# Altium schematic sheet Fri3D_IRA_00.SchDoc: Top Level
size A3; Date: 25/07/2021; DrawnBy: Wim Van Gool; DocumentNumber: 1; Revision: 00; SheetNumber: 1; SheetTotal: 4
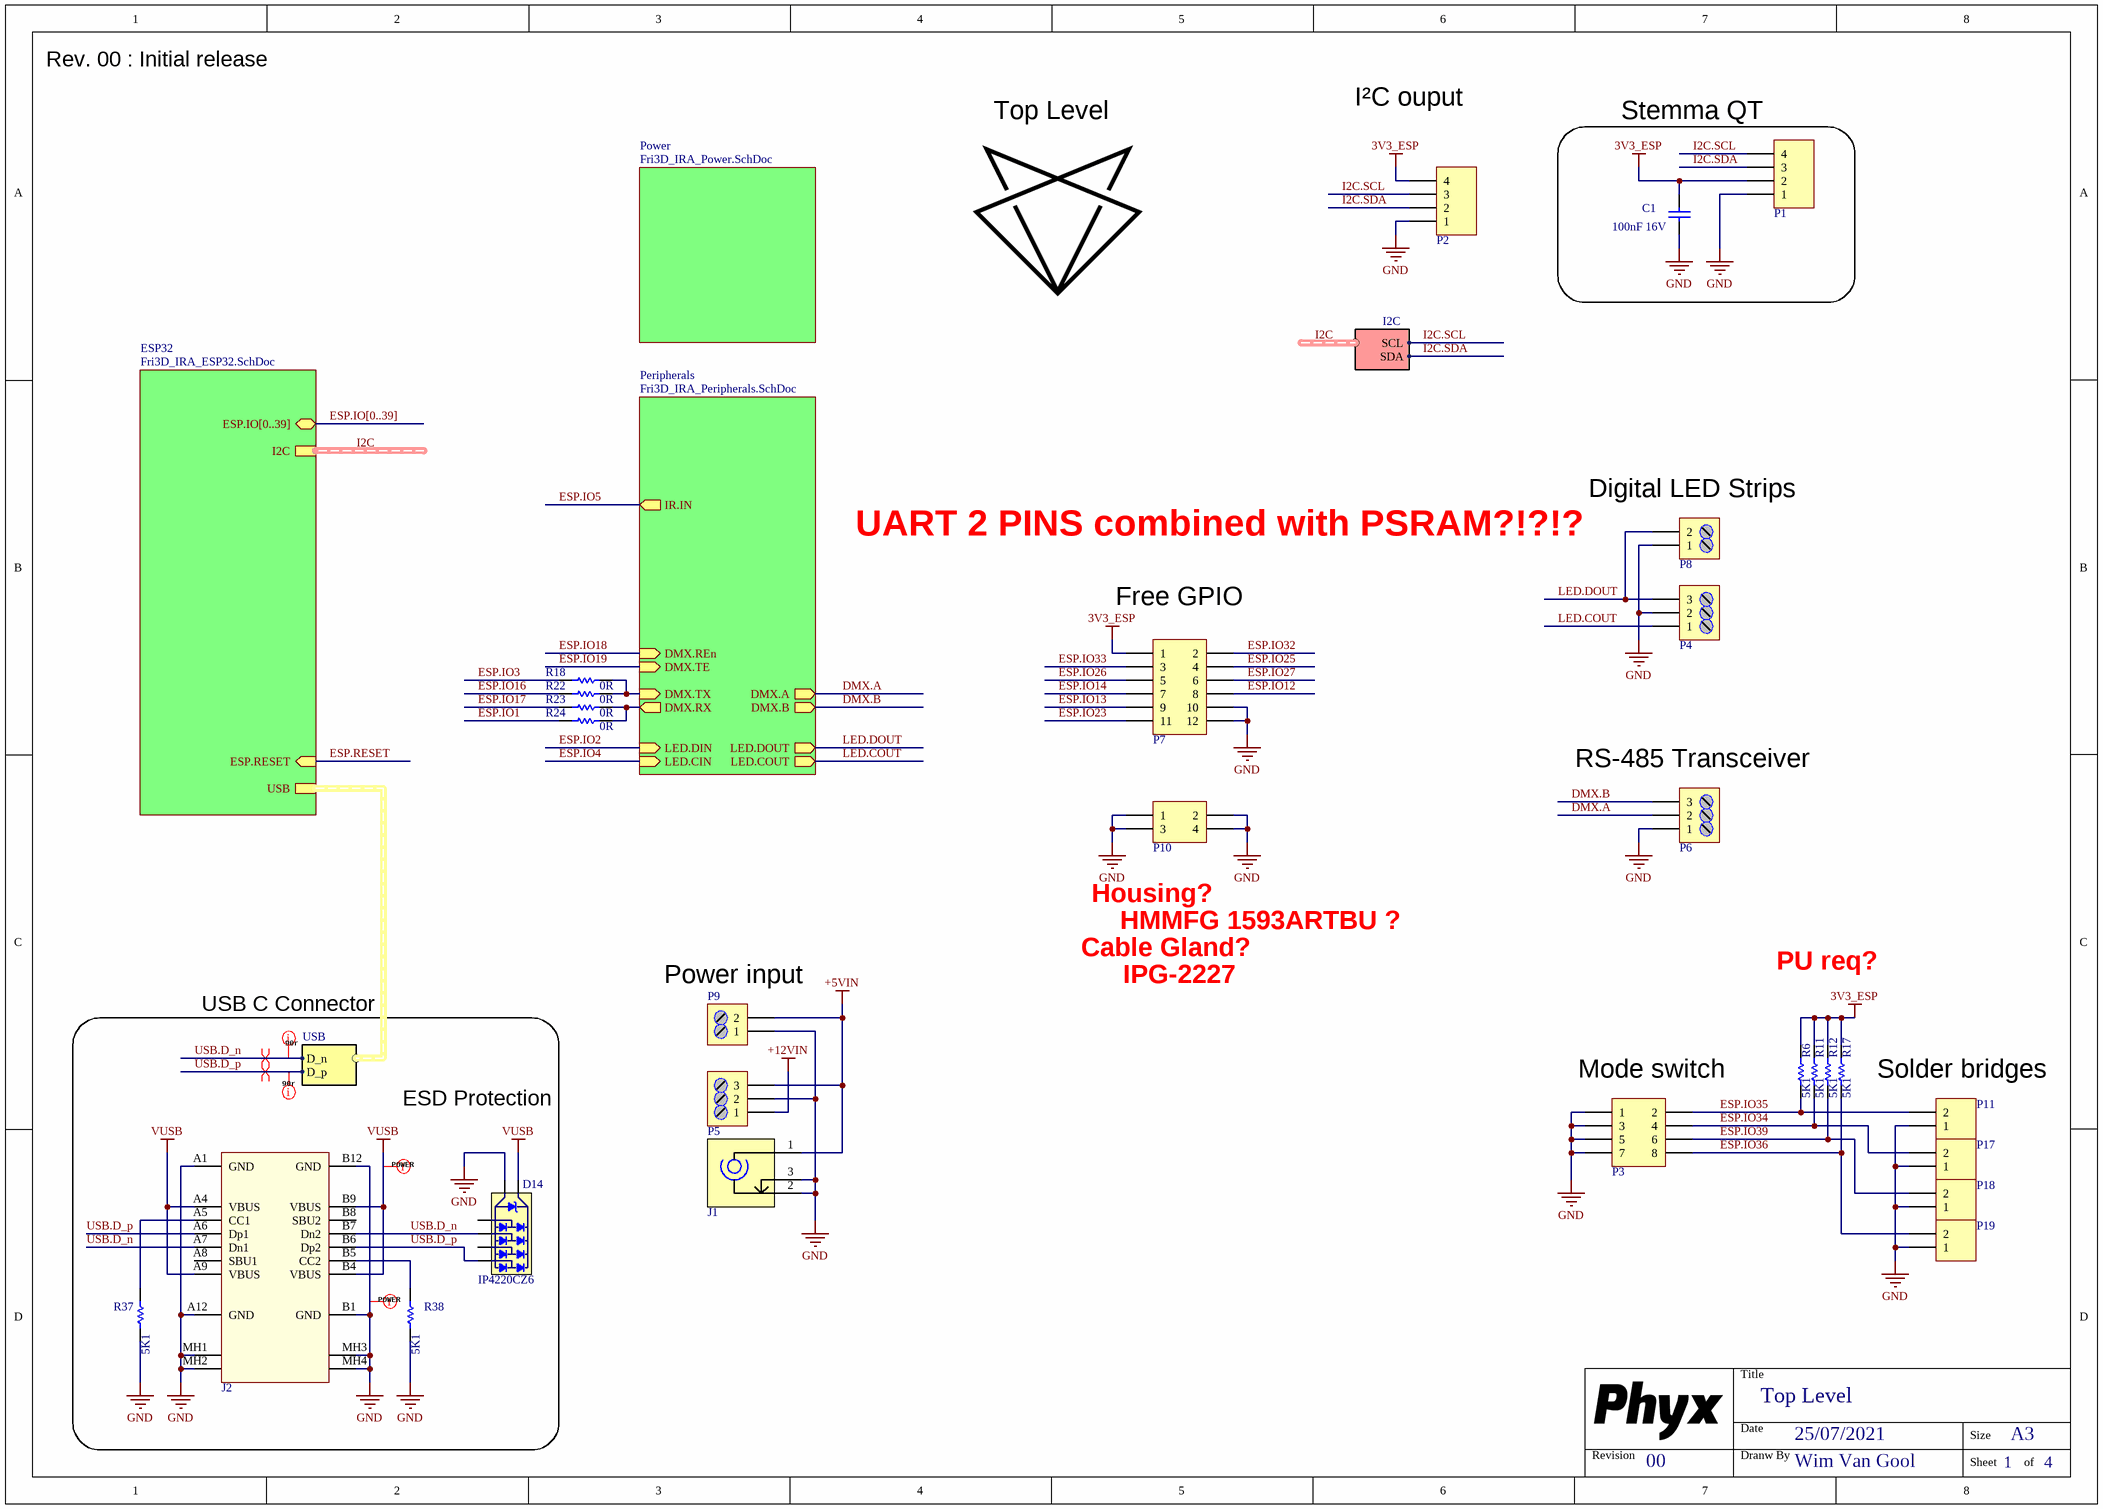
[diagram p0: Fri3D_IRA_00.SchDoc]

## Parts
C1  value 100nF 16V  [C0603_N]
D14  value IP4220CZ6  [NXP_SOT457]  (hidden comment: TVS Diode Dual USB)
J1  Socket RA 5.5  with 2.5 barrel  [Cliff_DC10]  (value not drawn)
J2  USB 2.0 C Reversible Receptacle Horizontal  [HRO_TYPE-C-31-M-12]  (value not drawn)
P1  Header 1.0mm RA Shrouded 4  [WE_665104131822]  (value not drawn)
P2  Header 4  [HDR1X4]  (value not drawn)
P3  Header 4x2  [HDR2X4]  (value not drawn)
P4  3 Way Screw HDR 5,08mm  [TERM_BLK-0508-3-90]  (value not drawn)
P5  3 Way Screw HDR 5,08mm  [TERM_BLK-0508-3-90]  (value not drawn)
P6  3 Way Screw HDR 5,08mm  [TERM_BLK-0508-3-90]  (value not drawn)
P7  Header 6X2  [HDR2X6]  (value not drawn)
P8  2 Way Screw HDR 5,08mm  [TERM_BLK-0508-2-90]  (value not drawn)
P9  2 Way Screw HDR 5,08mm  [TERM_BLK-0508-2-90]  (value not drawn)
P10  Header 2X2  [HDR2X2]  (value not drawn)
P11  Easy to solder connection  [SOLDER_SW_V_1MM]  (value not drawn)
P17  Easy to solder connection  [SOLDER_SW_V_1MM]  (value not drawn)
P18  Easy to solder connection  [SOLDER_SW_V_1MM]  (value not drawn)
P19  Easy to solder connection  [SOLDER_SW_V_1MM]  (value not drawn)
R6  value 5K1  [R0603_N]  (hidden comment: RESISTOR)
R11  value 5K1  [R0603_N]  (hidden comment: RESISTOR)
R12  value 5K1  [R0603_N]  (hidden comment: RESISTOR)
R17  value 5K1  [R0603_N]  (hidden comment: RESISTOR)
R18  value 0R  [R0603_N]  (hidden comment: RESISTOR)
R22  value 0R  [R0603_N]  (hidden comment: RESISTOR)
R23  value 0R  [R0603_N]  (hidden comment: RESISTOR)
R24  value 0R  [R0603_N]  (hidden comment: RESISTOR)
R37  value 5K1  [R0603_N]  (hidden comment: RESISTOR)
R38  value 5K1  [R0603_N]  (hidden comment: RESISTOR)

## Blocks framed on the sheet
Stemma QT: C1 P1

## Sub-sheets
ESP32 = Fri3D_IRA_ESP32.SchDoc: I2C (harness I2C), USB (harness USB), ESP.RESET (in), ESP.IO[0..39] (bidir)
Peripherals = Fri3D_IRA_Peripherals.SchDoc: LED.DIN (in), LED.DOUT (out), IR.IN (out), DMX.RX (out), DMX.A (out), DMX.B (out), LED.CIN (in), LED.COUT (out), DMX.TX (in), DMX.REn (in), DMX.TE (in)
Power = Fri3D_IRA_Power.SchDoc: no entries

## Harnesses
USB: D_p, D_n
I2C: SDA, SCL

## Nets
3V3_ESP: C1.1 P1.2 P2.4 P7.1 R6.1 R11.1 R12.1 R17.1
+5VIN: J1.1 P5.3 P9.2
+12VIN: P5.1
GND: C1.2 D14.2(GND) J1.2 J1.3 J2.A1(GND) J2.A12(GND) J2.B1(GND) J2.B12(GND) J2.MH1(Tab) J2.MH2(Tab) J2.MH3(Tab) J2.MH4(Tab) P1.1 P2.1 P3.1 P3.3 P3.5 P3.7 P4.2 P5.2 P6.1 P7.10 P7.12 P8.1 P9.1 P10.1 P10.2 P10.3 P10.4 P11.1 P17.1 P18.1 P19.1 R37.2 R38.2
VUSB: D14.5(VBus) J2.A4(VBUS) J2.A9(VBUS) J2.B4(VBUS) J2.B9(VBUS)
DMX.A: P6.2 ; sheet Peripherals/DMX.A
DMX.B: P6.3 ; sheet Peripherals/DMX.B
ESP.IO1: R24.2
ESP.IO2: sheet Peripherals/LED.DIN
ESP.IO3: R18.2
ESP.IO4: sheet Peripherals/LED.CIN
ESP.IO5: sheet Peripherals/IR.IN
ESP.IO12: P7.8
ESP.IO13: P7.9
ESP.IO14: P7.7
ESP.IO16: R22.2
ESP.IO17: R23.2
ESP.IO18: sheet Peripherals/DMX.REn
ESP.IO19: sheet Peripherals/DMX.TE
ESP.IO23: P7.11
ESP.IO25: P7.4
ESP.IO26: P7.5
ESP.IO27: P7.6
ESP.IO32: P7.2
ESP.IO33: P7.3
ESP.IO34: P3.4 P17.2 R11.2
ESP.IO35: P3.2 P11.2 R6.2
ESP.IO36: P3.8 P19.2 R17.2
ESP.IO39: P3.6 P18.2 R12.2
ESP.RESET: sheet ESP32/ESP.RESET
I2C.SCL: P1.4 P2.3 ; sheet ESP32/I2C.SCL
I2C.SDA: P1.3 P2.2 ; sheet ESP32/I2C.SDA
LED.COUT: P4.1 ; sheet Peripherals/LED.COUT
LED.DOUT: P4.3 P8.2 ; sheet Peripherals/LED.DOUT
USB.D_n: D14.1 J2.A7(Dn1) J2.B7(Dn2) ; sheet ESP32/USB.D_n
USB.D_p: D14.6 J2.A6(Dp1) J2.B6(Dp2) ; sheet ESP32/USB.D_p
NetJ2_A5: J2.A5(CC1) R37.1
NetJ2_B5: J2.B5(CC2) R38.1
NetR18_1: R18.1 R22.1 ; sheet Peripherals/DMX.TX
NetR23_1: R23.1 R24.1 ; sheet Peripherals/DMX.RX

Not connected (* = marked no-connect by the designer): D14 3 4; J2 A8(SBU1) B8(SBU2)

## Buses and harness runs
bus ESP.IO[0..39] = sheet ESP32/ESP.IO[0..39]
harness I2C = sheet ESP32/I2C

## Layout directives
net class 90r: USB.D_n, USB.D_p
differential pair: USB.D_n, USB.D_p
net class POWER: GND, VUSB

## Notes on the sheet
- Rev. 00 : Initial release
- I²C ouput
- (near P8) Digital LED Strips
- UART 2 PINS combined with PSRAM?!?!?
- (near P7) Free GPIO
- (near P6) RS-485 Transceiver
- (near P10) Housing?
- (near P9) Power input
- Cable Gland?
- IPG-2227
- HMMFG 1593ARTBU ?
- PU req?
- USB C Connector
- ESD Protection
- (near P3) Mode switch
- Solder bridges
- Title
- Revision
- Date
- Dranw By
- Size
- A3
- Sheet
- of

## Library data of the parts
C1 = CAP # 100nF 16V 0603: Capacitor Ceramic
D14 = TVS # IP4220CZ6 Dual USB: =Description; Supplier 1: Farnell; Supplier Part Number 1: 2143248
J1 = SCKT 2.5mm barrel: =Description; Value: Cliff_DC10B; Supplier 1: Farnell; Supplier Part Number 1: 224960
J2 = USB # C 2.0 RCPT TYPE-C-31-M-12: Value: TYPE-C-31-M-12; Supplier 1: China; Supplier Part Number 1: HRO TYPE-C-31-M-12; Supplier 2: LCSC; Supplier Part Number 2: C165948; Supplier 3: LCSC ALT; Supplier Part Number 3: C167321 / C319148
P1 = HDR # RA SHR 1.0mm 4way - 665104131822: Value: 665104131822; Supplier 1: Wurth; Supplier Part Number 1: 665104131822; Supplier 2: Mouser; Supplier Part Number 2: 710-665104131822
P2 = Pin Header 2.54mm 4way
P3 = Pin Header 2.54mm dual row 8way
P4-P6 = Terminal Block 5.08mm 3way: Value: PM5.08/3/90; Supplier 1: Farnell
P7 = Pin Header 2.54mm dual row 12way
P8 P9 = Terminal Block 5.08mm 2way: Value: PM5.08/2/90; Supplier 1: Farnell; Supplier Part Number 1: 1131853
P10 = Pin Header 2.54mm dual row 4way
P11 P17-P19 = SOLDER SW V 1MM: Value: NO BOM
R6 R11 R12 R17 R37 R38 = RES # 5K1 0603: Supplier 1: Farnell; Supplier Part Number 1: 2845922
R18 R22-R24 = RES # 0R 0603: Description: RES # 0R 0603; Supplier 1: Farnell; Supplier Part Number 1: 2447743; Supplier 3: Generic; Supplier Part Number 3: 0R 1% 0603